# EAGLE schematic f - HomeAutomation (EAGLE 9.1.1)
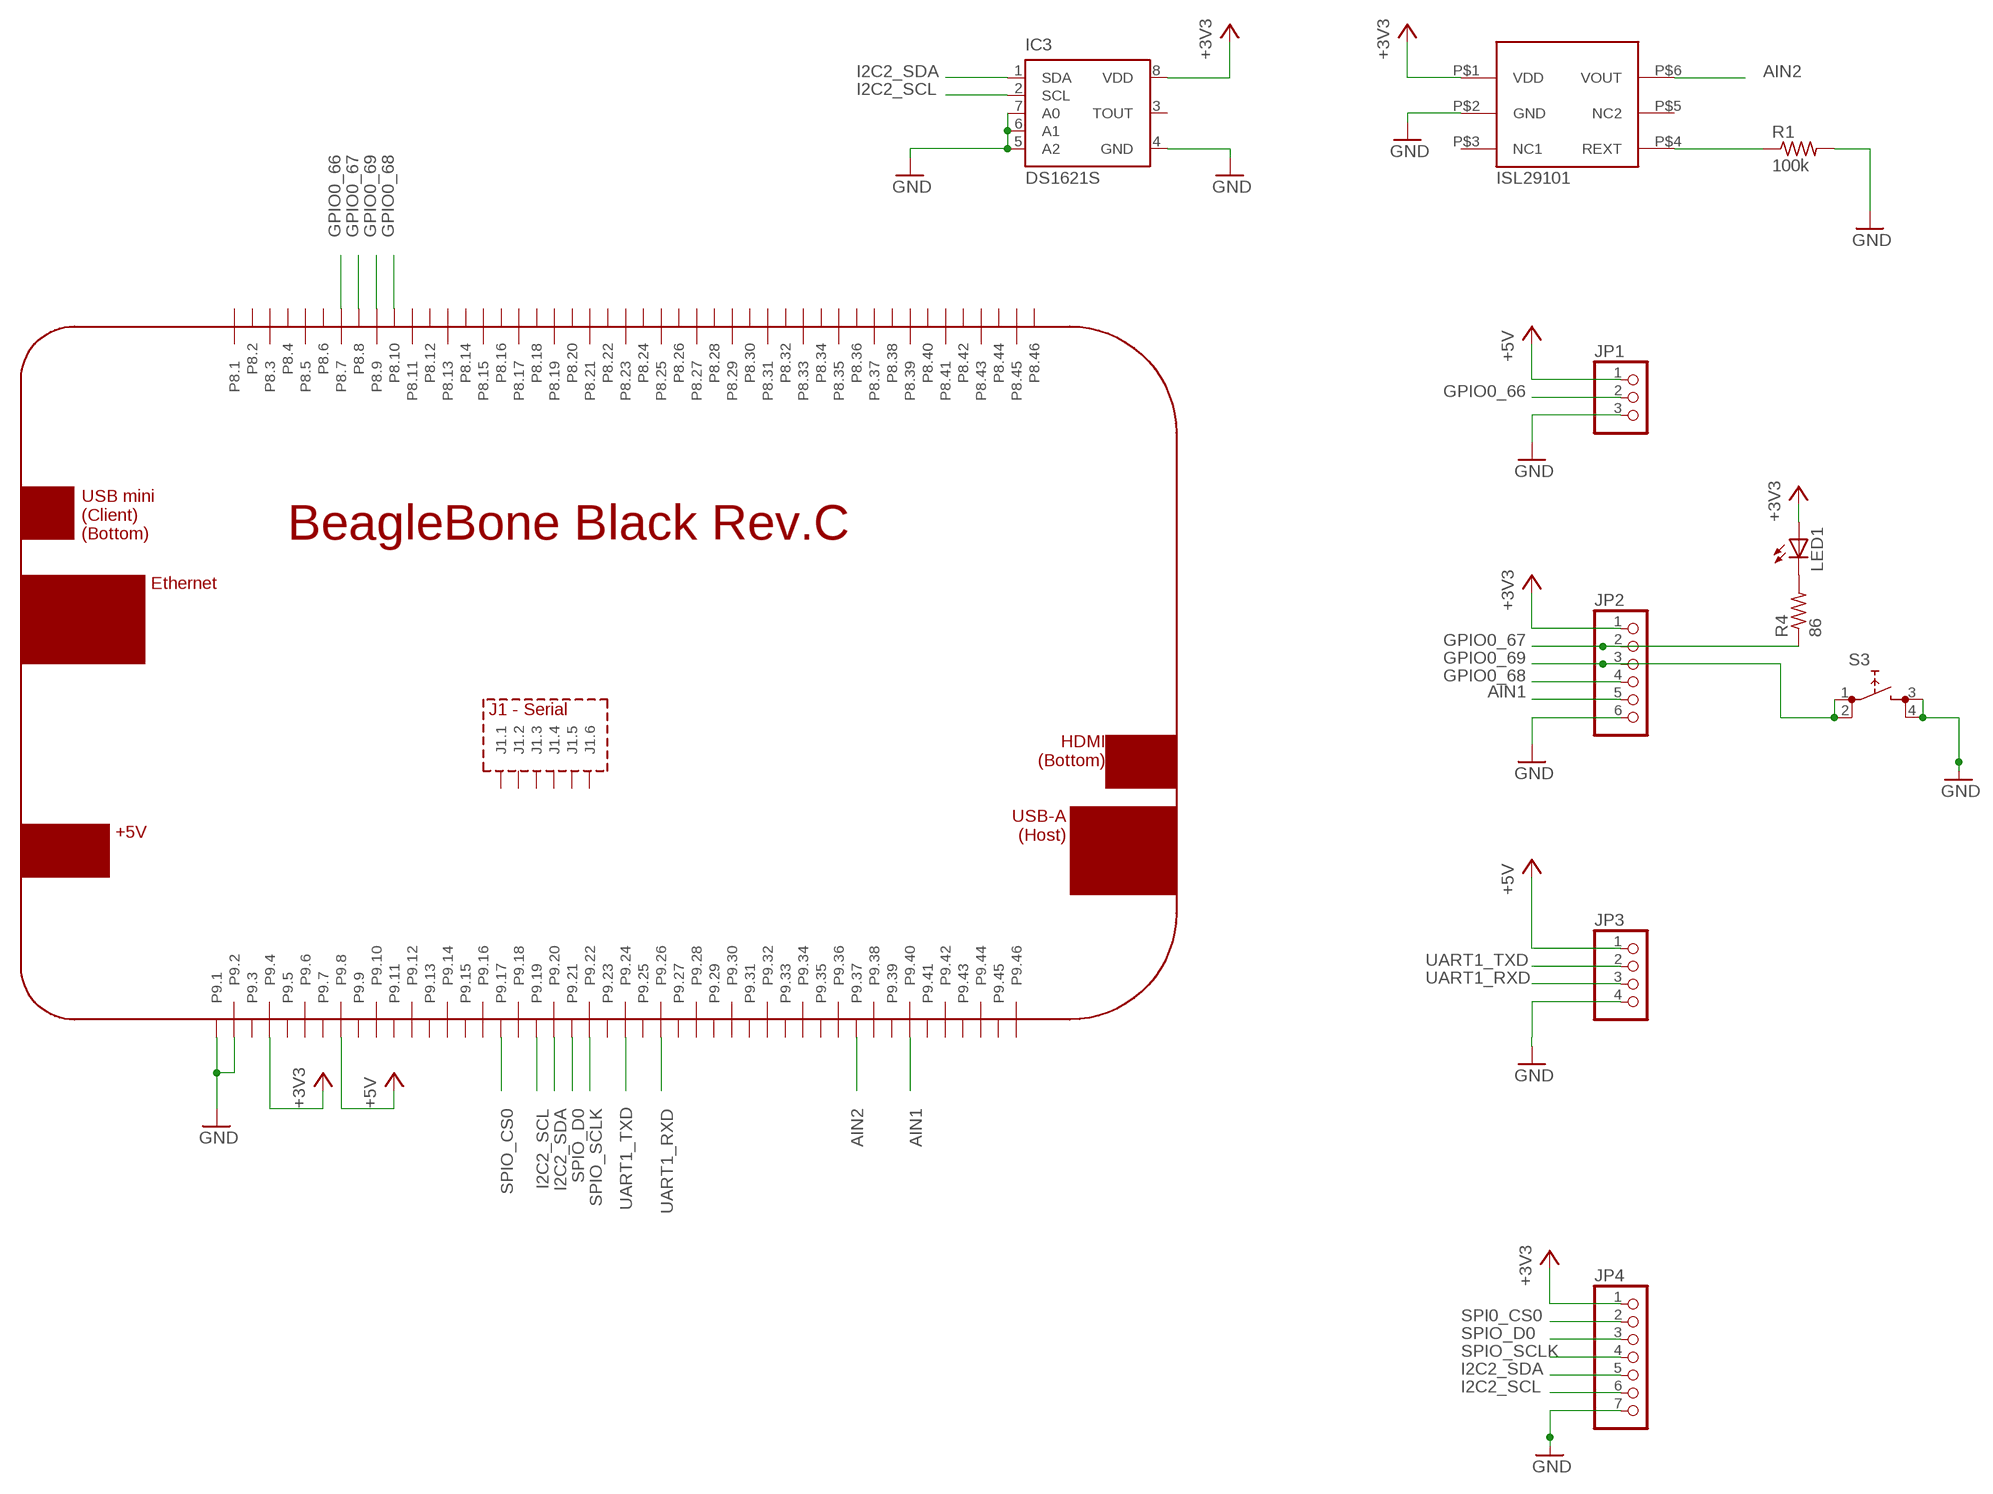
[diagram p0: schematic, sheet 1]

## Parts
IC3  DS1621S  [SO08]
JP1  PINHD-1X3  [1X03]
JP2  PINHD-1X6  [1X06]
JP3  PINHD-1X4  [1X04]
JP4  PINHD-1X7  [1X07]
LED1  LED3MM  [LED3MM]
PCB1  BEAGLEBONE_BLACK_CAPE  [BEAGLEBONE_BLACK_CAPE]
R1  100k  R-US_R0805  [R0805]
R4  86  R-US_R0805  [R0805]
S3  PUSHBUTTON  [TL1105SP]
U$1  ISL29101  [ODFN6]

## Nets
+3V3: IC3.8(VDD) JP2.1 JP4.1 LED1.A PCB1.P9.4 U$1.P$1(VDD)
+5V: JP1.1 JP3.1 PCB1.P9.8
AIN1: JP2.5 PCB1.P9.40
AIN2: PCB1.P9.37 U$1.P$6(VOUT)
GND: IC3.4(GND) IC3.5(A2) IC3.6(A1) IC3.7(A0) JP1.3 JP2.6 JP3.4 JP4.7 PCB1.P9.1 PCB1.P9.2 R1.2 S3.3 S3.4 U$1.P$2(GND)
GPIO0_66: JP1.2 PCB1.P8.7
GPIO0_67: JP2.2 PCB1.P8.8 R4.1
GPIO0_68: JP2.4 PCB1.P8.10
GPIO0_69: JP2.3 PCB1.P8.9 S3.1 S3.2
I2C2_SCL: IC3.2(SCL) JP4.6 PCB1.P9.19
I2C2_SDA: IC3.1(SDA) JP4.5 PCB1.P9.20
N$1: R1.1 U$1.P$4(REXT)
N$13: LED1.K(C) R4.2
SPI0_CS0: JP4.2
SPIO_CS0: PCB1.P9.17
SPIO_D0: JP4.3 PCB1.P9.21
SPIO_SCLK: JP4.4 PCB1.P9.22
UART1_RXD: JP3.3 PCB1.P9.26
UART1_TXD: JP3.2 PCB1.P9.24
Unconnected: IC3.3(TOUT) PCB1.J1.1 PCB1.J1.2 PCB1.J1.3 PCB1.J1.4 PCB1.J1.5 PCB1.J1.6 PCB1.P8.1 PCB1.P8.2 PCB1.P8.3 PCB1.P8.4 PCB1.P8.5 PCB1.P8.6 PCB1.P8.11 PCB1.P8.12 PCB1.P8.13 PCB1.P8.14 PCB1.P8.15 PCB1.P8.16 PCB1.P8.17 PCB1.P8.18 PCB1.P8.19 PCB1.P8.20 PCB1.P8.21 PCB1.P8.22 PCB1.P8.23 PCB1.P8.24 PCB1.P8.25 PCB1.P8.26 PCB1.P8.27 PCB1.P8.28 PCB1.P8.29 PCB1.P8.30 PCB1.P8.31 PCB1.P8.32 PCB1.P8.33 PCB1.P8.34 PCB1.P8.35 PCB1.P8.36 PCB1.P8.37 PCB1.P8.38 PCB1.P8.39 PCB1.P8.40 PCB1.P8.41 PCB1.P8.42 PCB1.P8.43 PCB1.P8.44 PCB1.P8.45 PCB1.P8.46 PCB1.P9.3 PCB1.P9.5 PCB1.P9.6 PCB1.P9.7 PCB1.P9.9 PCB1.P9.10 PCB1.P9.11 PCB1.P9.12 PCB1.P9.13 PCB1.P9.14 PCB1.P9.15 PCB1.P9.16 PCB1.P9.18 PCB1.P9.23 PCB1.P9.25 PCB1.P9.27 PCB1.P9.28 PCB1.P9.29 PCB1.P9.30 PCB1.P9.31 PCB1.P9.32 PCB1.P9.33 PCB1.P9.34 PCB1.P9.35 PCB1.P9.36 PCB1.P9.38 PCB1.P9.39 PCB1.P9.41 PCB1.P9.42 PCB1.P9.43 PCB1.P9.44 PCB1.P9.45 PCB1.P9.46 U$1.P$3(NC1) U$1.P$5(NC2)

## Library data of the parts
IC3 = maxim:DS1621: Digital Thermometer and Thermostat Source: http://pdfserv.maxim-ic.com/en/ds/DS1621.pdf
JP1 = pinhead:PINHD-1X3: PIN HEADER
JP2 = pinhead:PINHD-1X6: PIN HEADER
JP3 = pinhead:PINHD-1X4: PIN HEADER
JP4 = pinhead:PINHD-1X7: PIN HEADER
LED1 = SouthernConn:LED: LED
PCB1 = e14_BeagleBoneBlack_RevB:BEAGLEBONE_BLACK_CAPE
R1 = rcl:R-US_: RESISTOR, American symbol; SPICEPREFIX: R
R4 = rcl:R-US_: RESISTOR, American symbol
S3 = SouthernConn:PUSHBUTTON: PUSHBUTTON SWITCH Tactile Switch
U$1 = mdant:ISL29101